# EasyEDA Pro project ProProject_基于CW32单片机的无刷电机控制器（旋转变压器位置反馈）_2024-06-02.epro, schematic Schematic1
Create Date: 2024-06-01; Page Name: P2; Project Name: 基于CW32单片机的无刷电机控制器（旋转变压器位置反馈）; Schematic Name: Schematic1; Update Date: 2024-06-01; Company: 嘉立创EDA; Page Size: A4; Version: V1.0
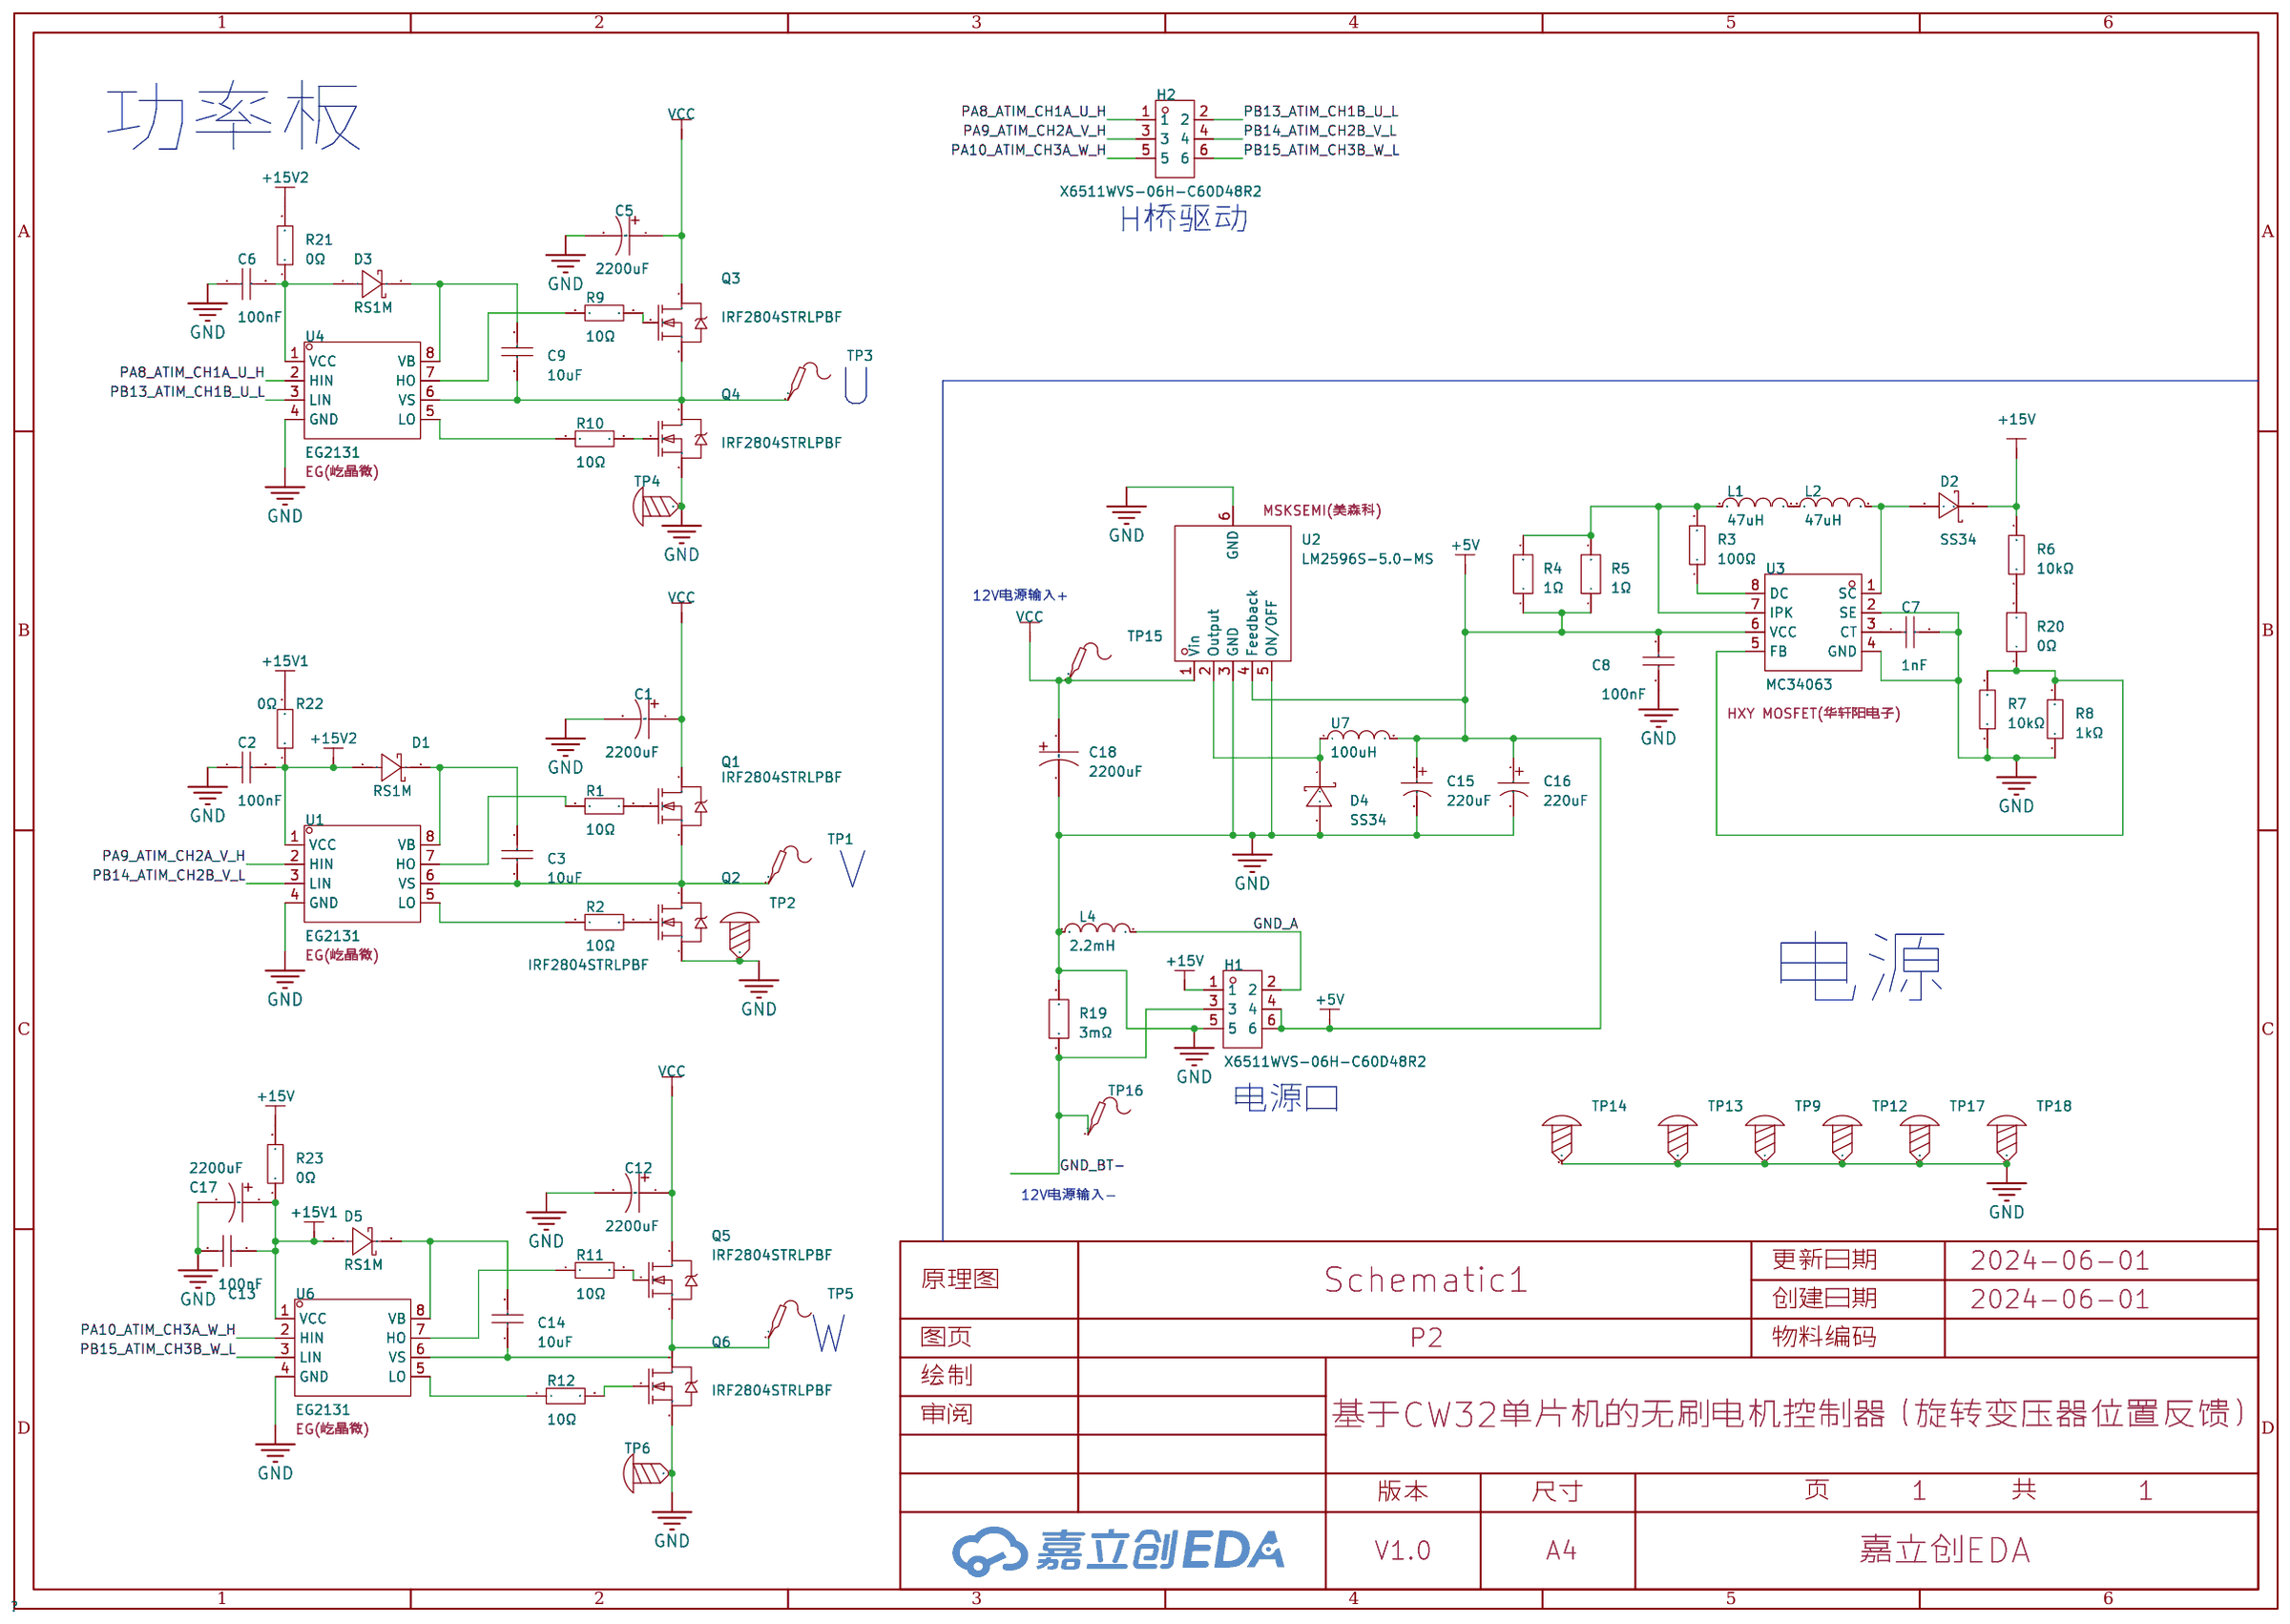
[diagram p3: schematic sheet]

## Parts
C1  2200uF  [CAP-SMD_BD16.0-L17.0-W17.0-LS18.0-FD]
C2  100nF  [C0603]
C3  10uF  [C1206]
C5  2200uF  [CAP-SMD_BD16.0-L17.0-W17.0-LS18.0-FD]
C6  100nF  [C0603]
C7  1nF  [C0603]
C8  100nF  [C0603]
C9  10uF  [C1206]
C12  2200uF  [CAP-SMD_BD16.0-L17.0-W17.0-LS18.0-FD]
C13  100nF  [C0603]
C14  10uF  [C1206]
C15  220uF  [CAP-SMD_BD6.3-L6.6-W6.6-LS7.2-R-RD]
C16  220uF  [CAP-SMD_BD6.3-L6.6-W6.6-LS7.2-R-RD]
C17  2200uF  [CAP-SMD_BD16.0-L17.0-W17.0-LS18.0-FD]
C18  2200uF  [CAP-SMD_BD16.0-L17.0-W17.0-LS18.0-FD]
D1  RS1M  [SMA_L4.3-W2.6-LS5.0-FD]
D2  SS34  [SMA_L4.3-W2.6-LS5.2-RD]
D3  RS1M  [SMA_L4.3-W2.6-LS5.0-FD]
D4  SS34  [SMA_L4.3-W2.6-LS5.2-RD]
D5  RS1M  [SMA_L4.3-W2.6-LS5.0-FD]
H1  X6511WVS-06H-C60D48R2  [HDR-SMD_6P-P2.54-V-M-LS4.8_R2]
H2  X6511WVS-06H-C60D48R2  [HDR-SMD_6P-P2.54-V-M-LS4.8_R2]
L1  47uH  [IND-SMD_L4.5-W4.0_SLF0403]
L2  47uH  [IND-SMD_L4.5-W4.0_SLF0403]
L4  2.2mH  [IND-SMD_L7.8-W7.0-A]
Q1  IRF2804STRLPBF  [D2PAK_L10.0-W9.0-P2.54-LS15.0-BR]
Q2  IRF2804STRLPBF  [D2PAK_L10.0-W9.0-P2.54-LS15.0-BR]
Q3  IRF2804STRLPBF  [D2PAK_L10.0-W9.0-P2.54-LS15.0-BR]
Q4  IRF2804STRLPBF  [D2PAK_L10.0-W9.0-P2.54-LS15.0-BR]
Q5  IRF2804STRLPBF  [D2PAK_L10.0-W9.0-P2.54-LS15.0-BR]
Q6  IRF2804STRLPBF  [D2PAK_L10.0-W9.0-P2.54-LS15.0-BR]
R1  10Ω  [R0603]
R2  10Ω  [R0603]
R3  100Ω  [R0603]
R4  1Ω  [R0603]
R5  1Ω  [R0603]
R6  10kΩ  [R0603]
R7  10kΩ  [R0603]
R8  1kΩ  [R0603]
R9  10Ω  [R0603]
R10  10Ω  [R0603]
R11  10Ω  [R0603]
R12  10Ω  [R0603]
R19  3mΩ  [R5930]
R20  0Ω  [R1206]
R21  0Ω  [R2512]
R22  0Ω  [R2512]
R23  0Ω  [R2512]
TP1  -  [Test-Point-0.5mm]
TP2  -  [M3螺丝]
TP3  -  [Test-Point-0.5mm]
TP4  -  [M3螺丝]
TP5  -  [Test-Point-0.5mm]
TP6  -  [M3螺丝]
TP9  -  [M3螺丝]
TP12  -  [M3螺丝]
TP13  -  [M3螺丝]
TP14  -  [M3螺丝]
TP15  -  [Test-Point-0.5mm]
TP16  -  [Test-Point-0.5mm]
TP17  -  [M3螺丝]
TP18  -  [M3螺丝]
U1  EG2131  [SOIC-8_L5.0-W4.0-P1.27-LS6.0-BL]
U2  LM2596S-5.0-MS  [TO-263-5_L10.0-W8.4-P1.70-LS15.3-BR]
U3  MC34063  [SOIC-8_L5.0-W4.0-P1.27-LS6.0-BL]
U4  EG2131  [SOIC-8_L5.0-W4.0-P1.27-LS6.0-BL]
U6  EG2131  [SOIC-8_L5.0-W4.0-P1.27-LS6.0-BL]
U7  100uH  [IND-SMD_L13.5-W12.8]

## Library data of the parts
C1 C5 C12 C17 C18 = VT1E222M1616: 容值:2200uF;精度:±20%;额定电压:25V;纹波电流:720mA@120Hz;等效串联电阻:-;; LCSC Part Name: 2200uF ±20% 25V; Supplier Part: C239249; Manufacturer: ROQANG(容强); Supplier Footprint: SMD,D16xL16.5mm; JLCPCB Part Class: 扩展库; Datasheet: https://atta.szlcsc.com/upload/public/pdf/source/20180703/C239252_12B8DCB9B2A5BC189A12B77924435115.pdf; Supplier: LCSC; Tolerance: ±20%; Rated Voltage: 25V; Ripple Current: 720mA@120Hz; φD: 16mm; L: 16.5mm; Lifetime @ Temp: 2000hrs@105℃; Operating Temperature: -40℃~+105℃
C2 C6 C8 C13 = 0603B104K500NT: 容值:100nF;精度:±10%;额定电压:50V;材质(温度系数):X7R;; LCSC Part Name: 100nF ±10% 50V; Supplier Part: C30926; Manufacturer: FH(风华); Supplier Footprint: 0603; JLCPCB Part Class: 扩展库; Datasheet: https://atta.szlcsc.com/upload/public/pdf/source/20200305/C486355_26A10D38EF8C2A5C37091D0039909270.pdf; Supplier: LCSC; Tolerance: ±10%; Voltage Rated: 50V; Temperature Coefficient: X7R
C3 C9 C14 = CL31A106KBHNNNE: 容值:10uF;精度:±10%;额定电压:50V;材质(温度系数):X5R;; LCSC Part Name: 10uF ±10% 50V; Supplier Part: C13585; Manufacturer: SAMSUNG(三星); Supplier Footprint: 1206; JLCPCB Part Class: 基础库; Datasheet: https://atta.szlcsc.com/upload/public/pdf/source/20160218/1457707763339.pdf; Supplier: LCSC; Tolerance: ±10%; Voltage Rated: 50V; Temperature Coefficient: X5R
C7 = CC0603JRNPO9BN102: 容值:1nF;精度:±5%;额定电压:50V;材质(温度系数):NP0;; LCSC Part Name: 1nF ±5% 50V; Supplier Part: C106246; Manufacturer: YAGEO(国巨); Supplier Footprint: 0603; JLCPCB Part Class: 扩展库; Datasheet: https://atta.szlcsc.com/upload/public/pdf/source/20170505/1493957838062.pdf; Supplier: LCSC; Tolerance: ±5%; Voltage Rated: 50V; Temperature Coefficient: NP0
C15 C16 = RVT1A221M0605: 容值:220uF;精度:±20%;额定电压:10V;纹波电流:-;等效串联电阻:-;; LCSC Part Name: 220uF ±20% 10V; Supplier Part: C3345; Manufacturer: HONOR(荣誉); Supplier Footprint: SMD,D6.3xL5.4mm; JLCPCB Part Class: 扩展库; Datasheet: https://atta.szlcsc.com/upload/public/pdf/source/20220520/1BCC52842751E84E020A4D0B70BC5F88.pdf; Supplier: LCSC; Tolerance: ±20%; Rated Voltage: 10V; φD: 6.3mm; L: 5.4mm; Lifetime @ Temp: 2000hrs@105℃; Operating Temperature: -55℃~+105℃
D1 D3 D5 = RS1M_C7420358: 二极管配置:独立式;正向压降(Vf):1.3V@1.0A;直流反向耐压(Vr):1kV;平均整流电流(Io):1A;反向恢复时间(trr):500ns;; LCSC Part Name: 电压:1kV 电流:1A; Supplier Part: C7420358; Manufacturer: 宏迦橙; Supplier Footprint: SMA(DO-214AC); JLCPCB Part Class: 扩展库; Datasheet: https://atta.szlcsc.com/upload/public/pdf/source/20230828/ED494E1D9B9D9217853F50BAC0953722.pdf; Supplier: LCSC; Diode Configuration: 独立式; Forward Voltage (Vf@If): 1.3V@1.0A; Reverse Voltage (Vr): 1kV; Average Rectified Current (Io): 1A; Reverse Leakage Current: 2uA@1000V; Reverse Recovery Time (trr): 500ns; Operating Temperature: -55℃~+150℃
D2 D4 = SS34_C8678: 二极管配置:独立式;正向压降(Vf):550mV@3A;直流反向耐压(Vr):40V;平均整流电流(Io):3A;; LCSC Part Name: 电压:40V 电流:3A; Supplier Part: C8678; Manufacturer: MDD; Supplier Footprint: SMA(DO-214AC); JLCPCB Part Class: 基础库; Datasheet: https://atta.szlcsc.com/upload/public/pdf/source/20230314/A80AE34493C69B89E2F4B1712F433538.pdf; Supplier: LCSC; Diode Configuration: 独立式; Forward Voltage (Vf@If): 550mV@3A; Reverse Voltage (Vr): 40V; Average Rectified Current (Io): 3A; Reverse Leakage Current (Ir): 500uA@40V
H1 H2 = X6511WVS-06H-C60D48R2: 插针结构:1x6P;间距:2.54mm;行距:2.54mm;圆针/方针:方针;安装类型:-;排数:单排;总PIN位数:6P;额定电流:3A;额定电压:250V;配合针长度:6mm;塑高:2.5mm;端接针长度:4.8mm;触头材质:黄铜;触头镀层:金;工作温度范围:-40℃~+105℃;焊接温度(最大值):260℃;颜色:黑色;; LCSC Part Name: 1x6P 间距:2.54mm 方针; Supplier Part: C2883763; Manufacturer: XKB Connection(中国星坤); Supplier Footprint: SMD,P=2.54mm; JLCPCB Part Class: 扩展库; Datasheet: https://atta.szlcsc.com/upload/public/pdf/source/20200909/C780060_F941EB1B69F43B5D6329EAF74E2E27BB.pdf; Supplier: LCSC; Pin Structure: 1x6P; Pitch: 2.54mm; Row Spacing: 2.54mm; Circluar Pins/Square Pins: 方针; Number of Rows: 单排; Number of Pins: 6P; Current Rating (Max): 3A; Voltage Rating (Max): 250V; Length of Mating Pin: 6mm; Insulation Height: 2.5mm; Length of End Connection Pin: 4.8mm; Contact Material: 黄铜; Contact Plating: 金; Operating Temperature Range: -40℃~+105℃; Soldering Temperature(Max): 260℃; Color: 黑色
L1 L2 = SLF0403-470KTT: 电感值:47uH;精度:±10%;额定电流:540mA;; LCSC Part Name: 47uH ±10%; Supplier Part: C182152; Manufacturer: Sunltech(韩国顺磁); Supplier Footprint: SMD; JLCPCB Part Class: 扩展库; Datasheet: https://atta.szlcsc.com/upload/public/pdf/source/20180622/C182201_C2E2778B6752CF513C201C52BBFBA88C.pdf; Supplier: LCSC; Tolerance: ±10%; Rated Current: 540mA; DC Resistance (DCR): 844mΩ
L4 = PSPCAQ75-222K: 电感值:2.2mH;精度:±10%;额定电流:260mA;饱和电流(Isat):260mA;; LCSC Part Name: 2.2mH ±10% 260mA; Supplier Part: C436456; Manufacturer: PROD(谱罗德); Supplier Footprint: SMD,7x7.8mm; JLCPCB Part Class: 扩展库; Datasheet: https://atta.szlcsc.com/upload/public/pdf/source/20200813/C436438_F24757E2149B55620A467CE22B989FD9.pdf; Supplier: LCSC; Tolerance: ±10%; Rated Current: 260mA; Saturation Current (Isat): 260mA; DC Resistance (DCR): 4.85Ω; Ratings: AEC-Q200
Q1-Q6 = IRF2804STRLPBF: 类型:N沟道;漏源电压(Vdss):40V;连续漏极电流(Id):75A;功率(Pd):300W;导通电阻(RDS(on)@Vgs,Id):2mΩ@10V,75A;阈值电压(Vgs(th)@Id):4V@250uA;; LCSC Part Name: N沟道 耐压:40V 电流:75A; Supplier Part: C459951; Manufacturer: Infineon(英飞凌); Supplier Footprint: D2PAK; JLCPCB Part Class: 扩展库; Datasheet: https://atta.szlcsc.com/upload/public/pdf/source/20191122/C459951_C5063D70B8F4262A32A22B385B43E8D0.pdf; Supplier: LCSC; Type: N沟道; Drain Source Voltage (Vdss): 40V; Continuous Drain Current (Id): 75A; Power Dissipation (Pd): 300W; Drain Source On Resistance (RDS(on)@Vgs,Id): 2mΩ@10V,75A; Gate Threshold Voltage (Vgs(th)@Id): 4V@250uA; Total Gate Charge (Qg@Vgs): 240nC@10V; Input Capacitance (Ciss@Vds): 6.45nF@25V; Operating Temperature: -55℃~+175℃@(Tj)
R1 R2 R9-R12 = 0603WAF100JT5E: 电阻类型:厚膜电阻;阻值:10Ω;精度:±1%;功率:100mW;最大工作电压:75V;温度系数:±400ppm/℃;; LCSC Part Name: 10Ω ±1% 100mW 厚膜电阻; Supplier Part: C22859; Manufacturer: UNI-ROYAL(厚声); Supplier Footprint: 0603; JLCPCB Part Class: 基础库; Datasheet: https://atta.szlcsc.com/upload/public/pdf/source/20200306/C422600_1E6D84923E4A46A82E41ADD87F860B5C.pdf; Supplier: LCSC; Type: 厚膜电阻; Tolerance: ±1%; Power(Watts): 100mW; Overload Voltage (Max): 75V; Temperature Coefficient: ±400ppm/℃; Operating Temperature Range: -55℃~+155℃
R3 = RC0603FR-07100RL: 电阻类型:厚膜电阻;阻值:100Ω;精度:±1%;功率:100mW;最大工作电压:75V;温度系数:±100ppm/℃;; LCSC Part Name: 厚膜电阻 100Ω ±1% 100mW; Supplier Part: C105588; Manufacturer: YAGEO(国巨); Supplier Footprint: 0603; JLCPCB Part Class: 扩展库; Datasheet: https://atta.szlcsc.com/upload/public/pdf/source/20180316/70C0E2BDAE7FCC62C531A5A58D202EE1.pdf; Supplier: LCSC; Type: 厚膜电阻; Tolerance: ±1%; Power(Watts): 100mW; Overload Voltage (Max): 75V; Temperature Coefficient: ±100ppm/℃; Operating Temperature Range: -55℃~+155℃
R4 R5 = SCR0603F1R: 电阻类型:厚膜电阻;阻值:1Ω;精度:±1%;功率:100mW;最大工作电压:75V;; LCSC Part Name: 1Ω ±1%; Supplier Part: C3016186; Manufacturer: VO(翔胜); Supplier Footprint: 0603; JLCPCB Part Class: 扩展库; Datasheet: https://atta.szlcsc.com/upload/public/pdf/source/20220513/247AF9639BA21CF93567DC289CCC6A22.pdf; Supplier: LCSC; Type: 厚膜电阻; Tolerance: ±1%; Power(Watts): 100mW; Overload Voltage (Max): 75V; Operating Temperature Range: -55℃~+155℃
R6 R7 = RC0603FR-0710KL: 电阻类型:厚膜电阻;阻值:10kΩ;精度:±1%;功率:100mW;最大工作电压:75V;温度系数:±100ppm/℃;; LCSC Part Name: 厚膜电阻 10kΩ ±1% 100mW; Supplier Part: C98220; Manufacturer: YAGEO(国巨); Supplier Footprint: 0603; JLCPCB Part Class: 扩展库; Datasheet: https://atta.szlcsc.com/upload/public/pdf/source/20180927/C295883_E8D83085EA81BD7DE0B2B681138C15EE.pdf; Supplier: LCSC; Type: 厚膜电阻; Tolerance: ±1%; Power(Watts): 100mW; Overload Voltage (Max): 75V; Temperature Coefficient: ±100ppm/℃; Operating Temperature Range: -55℃~+155℃
R8 = RC0603FR-071KL: 电阻类型:厚膜电阻;阻值:1kΩ;精度:±1%;功率:100mW;最大工作电压:75V;温度系数:±100ppm/℃;; LCSC Part Name: 厚膜电阻 1kΩ ±1% 100mW; Supplier Part: C22548; Manufacturer: YAGEO(国巨); Supplier Footprint: 0603; JLCPCB Part Class: 扩展库; Datasheet: https://atta.szlcsc.com/upload/public/pdf/source/20180316/70C0E2BDAE7FCC62C531A5A58D202EE1.pdf; Supplier: LCSC; Type: 厚膜电阻; Tolerance: ±1%; Power(Watts): 100mW; Overload Voltage (Max): 75V; Temperature Coefficient: ±100ppm/℃; Operating Temperature Range: -55℃~+155℃
R19 = EBWS5930F3L00K9L: 电阻类型:采样电阻;阻值:3mΩ;精度:±1%;额定压降:-;功率:7W;温度系数:±100ppm/℃;安装方式:贴片;; LCSC Part Name: 3mΩ ±1% 7W; Supplier Part: C494596; Manufacturer: RESI(开步睿思）; Supplier Footprint: 5930; JLCPCB Part Class: 扩展库; Datasheet: https://atta.szlcsc.com/upload/public/pdf/source/20200428/C494572_1906A236A7F16EA247B6F3B5657545A5.pdf; Supplier: LCSC; Type: 采样电阻; Tolerance: ±1%; Power(Watts): 7W; Temperature Coefficient: ±100ppm/℃; Mounting Sytle: 贴片
R20 = FRC1206P000 TS: 电阻类型:厚膜电阻;阻值:0Ω;精度:±5%;功率:250mW;最大工作电压:200V;; LCSC Part Name: 0Ω ±5% 250mW 厚膜电阻; Supplier Part: C2907406; Manufacturer: FOJAN(富捷); Supplier Footprint: 1206; JLCPCB Part Class: 扩展库; Datasheet: https://atta.szlcsc.com/upload/public/pdf/source/20211221/925EC7D7225764EE0046F22065062C87.pdf; Supplier: LCSC; Type: 厚膜电阻; Tolerance: ±5%; Power(Watts): 250mW; Overload Voltage (Max): 200V; Operating Temperature Range: -55℃~+155℃
R21-R23 = 25121WJ0000T4E: 电阻类型:厚膜电阻;阻值:0Ω;精度:±5%;功率:1W;最大工作电压:200V;温度系数:±800ppm/℃;; LCSC Part Name: 0Ω ±5% 1W 厚膜电阻; Supplier Part: C25469; Manufacturer: UNI-ROYAL(厚声); Supplier Footprint: 2512; JLCPCB Part Class: 扩展库; Datasheet: https://atta.szlcsc.com/upload/public/pdf/source/20200306/C422600_1E6D84923E4A46A82E41ADD87F860B5C.pdf; Supplier: LCSC; Type: 厚膜电阻; Tolerance: ±5%; Power(Watts): 1W; Overload Voltage (Max): 200V; Temperature Coefficient: ±800ppm/℃; Operating Temperature Range: -55℃~+155℃
TP1 TP3 TP5 TP15 TP16 = Test-Point: Test Point 测试点
TP2 TP4 TP6 TP9 TP12-TP14 TP17 TP18 = M3螺丝: Supplier Footprint: 插件
U1 U4 U6 = EG2131: Supplier Part: C193777; Manufacturer: EG(屹晶微); Supplier Footprint: SOIC-8; JLCPCB Part Class: 扩展库; Datasheet: https://atta.szlcsc.com/upload/public/pdf/source/20180528/C193777_0A452F93B99FD4EB2A9D54E9055DABCE.pdf; Supplier: LCSC
U2 = LM2596S-5.0-MS: 功能类型:降压型;输出类型:-;输入电压:7V~40V;输出电压:5V;输出电流(最大值):3A;; LCSC Part Name: Vin=7V-40V Vout=5V 3A大电流; Supplier Part: C5174628; Manufacturer: MSKSEMI(美森科); Supplier Footprint: TO-263-5L; JLCPCB Part Class: 扩展库; Datasheet: https://atta.szlcsc.com/upload/public/pdf/source/20221027/4361E163E0CC4DA461A3D8885FDCEFBB.pdf; Supplier: LCSC; Function: 降压型; Input Voltage: 7V~40V; Output Voltage: 5V; Output Current (Max): 3A; Switching Frequency: 150kHz; Synchronous Rectification: 否; Number of Outputs: 1; Topology: 降压式; Switch tube (built-in/external): 内置
U3 = MC34063_C5349988: 功能类型:升降压型;输出类型:可调;输入电压:3V~40V;输出电压:1.25V~40V;输出电流(最大值):1.3A;; Supplier Part: C5349988; Manufacturer: HXY MOSFET(华轩阳电子); Supplier Footprint: SOP-8; JLCPCB Part Class: 扩展库; Datasheet: https://atta.szlcsc.com/upload/public/pdf/source/20231229/D1A87F39F2F1E3F68C55B6C50423EC0B.pdf; Supplier: LCSC; Function: 升降压型; Output Type: 可调; Input Voltage: 3V~40V; Output Voltage: 1.25V~40V; Output Current (Max): 1.3A; Switching Frequency: 100kHz; Operating Temperature: 0℃~+70℃; Number of Outputs: 1; Switch tube (built-in/external): 内置
U7 = APH1265T101M: 电感值:100uH;精度:±20%;额定电流:3A;饱和电流(Isat):3.3A;类型:一体成型电感;; LCSC Part Name: 100uH ±20% 3.3A; Supplier Part: C5349629; Manufacturer: APV(爱普微); Supplier Footprint: SMD,13.5x12.8mm; JLCPCB Part Class: 扩展库; Datasheet: https://atta.szlcsc.com/upload/public/pdf/source/20230920/8DF4F91CA8787177DE496A10F73889DA.pdf; Supplier: LCSC; Tolerance: ±20%; Rated Current: 3A; Saturation Current (Isat): 3.3A; DC Resistance (DCR): 170mΩ; Type: 一体成型电感

## Nets
+5V: C8.2 C15.1 C16.1 H1.4 H1.6 R4.1 R5.1 U2.4(Feedback) U3.6(VCC) U7.2
+15V: D2.1(K) H1.1 R6.2 R23.2
+15V1: C13.2 C17.1 D5.1(A) R22.2 R23.1 U6.1(VCC)
+15V2: C2.2 D1.1(A) R21.2 R22.1 U1.1(VCC)
GND: C1.2 C2.1 C5.2 C6.1 C7.2 C8.1 C12.2 C13.1 C15.2 C16.2 C17.2 C18.2 D4.2(A) H1.5 L4.1 Q2.3(S) Q4.3(S) Q6.3(S) R7.1 R8.1 R19.2 TP2.1 TP4.1 TP6.1 TP9.1 TP12.1 TP13.1 TP14.1 TP17.1 TP18.1 U1.4(GND) U2.3(GND) U2.5(ON/OFF) U2.6(GND) U3.2(SE) U3.4(GND) U4.4(GND) U6.4(GND)
GND_A: H1.2 L4.2
GND_BT-: H1.3 R19.1 TP16.1
VCC: C1.1 C5.1 C12.1 C18.1 Q1.2(D) Q3.2(D) Q5.2(D) TP15.1 U2.1(Vin)
PA8_ATIM_CH1A_U_H: H2.1 U4.2(HIN)
PA9_ATIM_CH2A_V_H: H2.3 U1.2(HIN)
PA10_ATIM_CH3A_W_H: H2.5 U6.2(HIN)
PB13_ATIM_CH1B_U_L: H2.2 U4.3(LIN)
PB14_ATIM_CH2B_V_L: H2.4 U1.3(LIN)
PB15_ATIM_CH3B_W_L: H2.6 U6.3(LIN)
$2N841: R2.1 U1.5(LO)
$2N1882: D4.1(K) U2.2(Output) U7.1
$2N2223: R3.1 U3.8(DC)
$2N2340: L1.2 L2.1
$2N2437: C7.1 U3.3(CT)
$2N2721: R7.2 R8.2 R20.1 U3.5(FB)
$2N2790: D2.2(A) L2.2 U3.1(SC)
$2N6462: Q3.1(G) R9.2
$2N6470: R10.1 U4.5(LO)
$2N6475: C6.2 D3.1(A) R21.1 U4.1(VCC)
$2N6902: Q6.1(G) R12.2
$2N6903: Q5.1(G) R11.2
$2N6911: R12.1 U6.5(LO)
$2N7060: C3.1 Q1.3(S) Q2.2(D) TP1.1 U1.6(VS)
$2N7066: C9.1 Q3.3(S) Q4.2(D) TP3.1 U4.6(VS)
$2N10076: L1.1 R3.2 R4.2 R5.2 U3.7(IPK)
$2N13152: R9.1 U4.7(HO)
$2N13180: C9.2 D3.2(K) U4.8(VB)
$2N13207: R11.1 U6.7(HO)
$2N13222: C14.2 D5.2(K) U6.8(VB)
$2N13249: R1.1 U1.7(HO)
$2N13264: C3.2 D1.2(K) U1.8(VB)
$2N15080: Q1.1(G) R1.2
$2N15124: Q2.1(G) R2.2
$2N15258: Q4.1(G) R10.2
$2N15347: C14.1 Q5.3(S) Q6.2(D) TP5.1 U6.6(VS)
$2N32860: R6.1 R20.2

## Notes on the sheet
- 功率板
- H桥驱动
- U
- 12V电源输入+
- V
- 电源
- 电源口
- 12V电源输入-
- W
